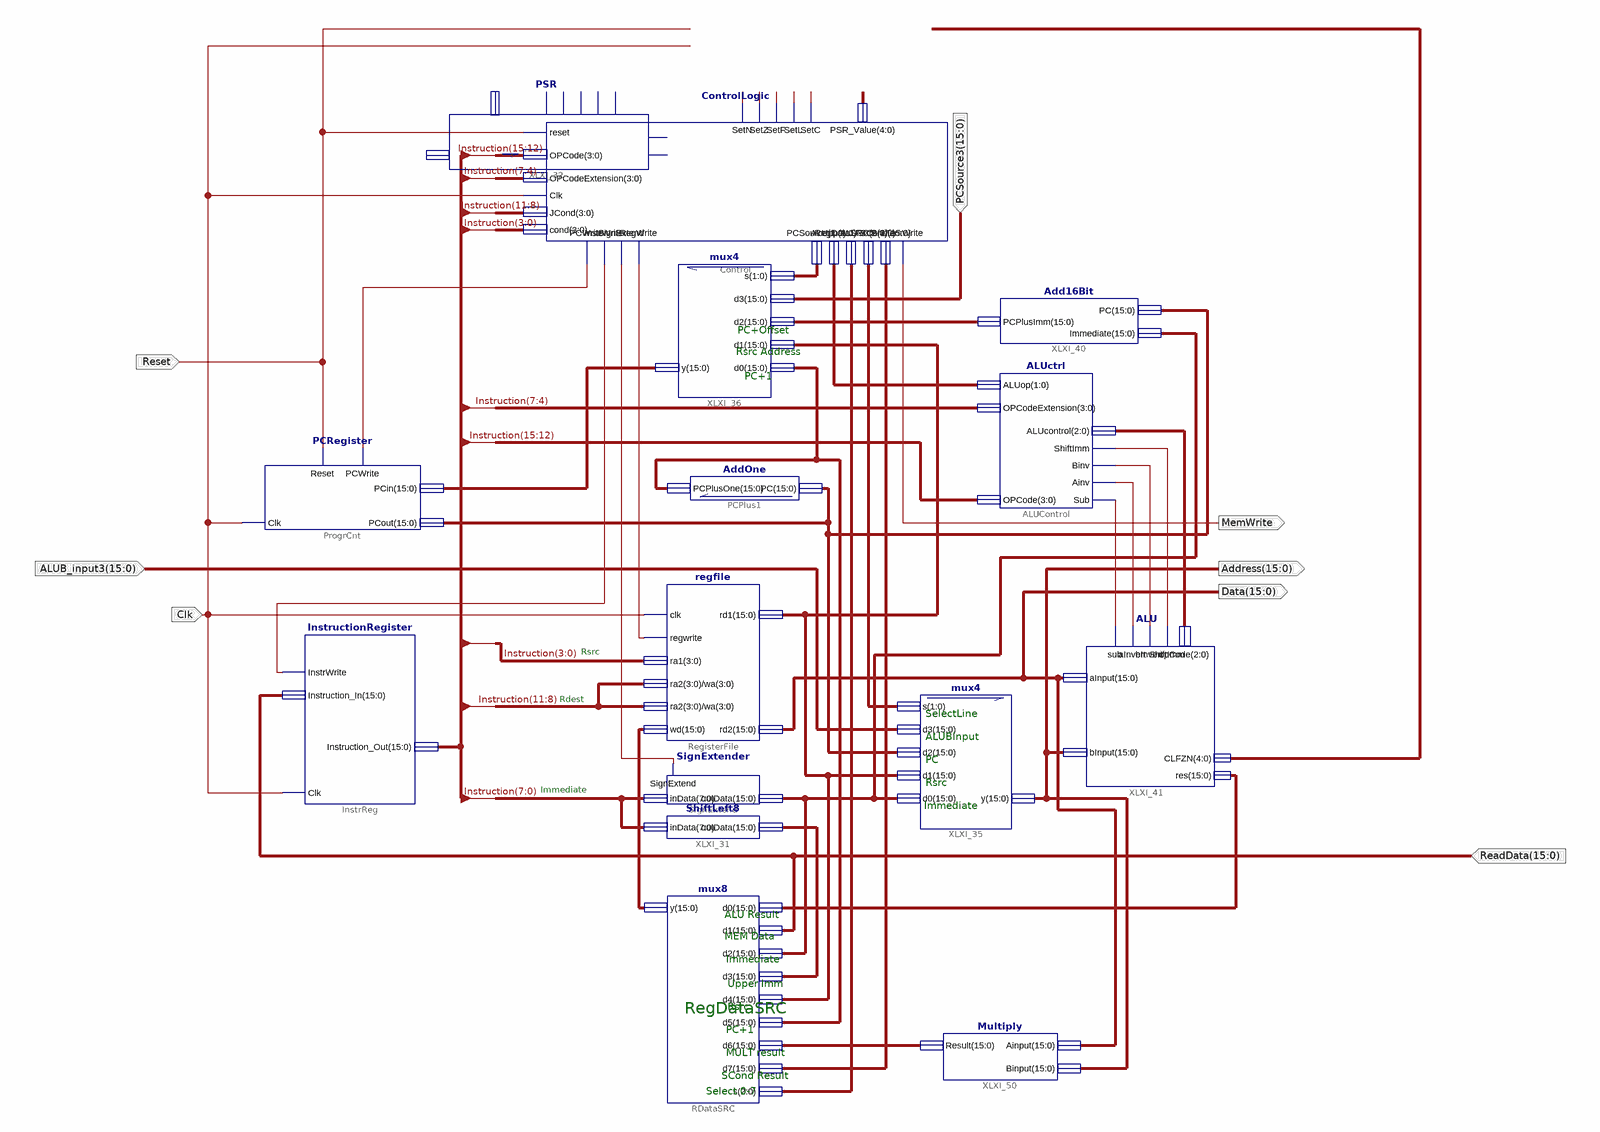
[diagram p0: schematic sheet 1]
// Xilinx ISE schematic Processor.sch (spartan3e) as structural Verilog: 15 symbols, 8 ports
module Processor (
  input  Clk,
  input  Reset,
  input  [15:0] ReadData,
  input  [15:0] ALUB_input3,
  input  [15:0] PCSource3,
  output MemWrite,
  output [15:0] Address,
  output [15:0] Data
);

  wire aInv, bInv, Cin, InstrWrite, PCWrite, RegWrite, XLXN_319, XLXN_326, XLXN_361, XLXN_362, XLXN_363,
       XLXN_364, XLXN_365;
  wire [1:0] XLXN_325, XLXN_388, XLXN_420;
  wire [2:0] XLXN_172, XLXN_342;
  wire [4:0] XLXN_372, XLXN_377;
  wire [15:0] DIV, Immediate, Instruction, MULT, ProgramCounter, Rsrc, XLXN_20, XLXN_192, XLXN_343, XLXN_344,
       XLXN_408, XLXN_413;

  regfile RegisterFile (
    .clk(Clk), .regwrite(RegWrite), .ra1(Instruction[3:0]), .ra2(Instruction[11:8]), .wa(Instruction[11:8]),
    .wd(XLXN_20), .rd1(Rsrc), .rd2(Data));
  SignExtender SignExtend (.SignExtend(XLXN_326), .inData(Instruction[7:0]), .outData(Immediate));
  ALUctrl ALUControl (
    .ALUop(XLXN_325), .OPCodeExtension(Instruction[7:4]), .OPCode(Instruction[15:12]), .Ainv(aInv),
    .Binv(bInv), .Sub(Cin), .ShiftImm(XLXN_319), .ALUcontrol(XLXN_172));
  InstructionRegister InstrReg (
    .Clk(Clk), .Instruction_In(ReadData), .Instruction_Out(Instruction), .InstrWrite(InstrWrite));
  PCRegister ProgrCnt (.PCWrite(PCWrite), .Reset(Reset), .PCin(XLXN_408), .PCout(XLXN_344), .Clk(Clk));
  AddOne PCPlus1 (.PC(XLXN_344), .PCPlusOne(ProgramCounter));
  ShiftLeft8 XLXI_31 (.inData(Instruction[7:0]), .outData(XLXN_343));
  mux8 RDataSRC (
    .d0(XLXN_192), .d1(ReadData), .d2(Immediate), .d3(XLXN_343), .d4(Rsrc), .d5(ProgramCounter), .d6(MULT),
    .d7(DIV), .s(XLXN_342), .y(XLXN_20));
  mux4 XLXI_35 (.d0(Immediate), .d1(Rsrc), .d2(XLXN_344), .d3(ALUB_input3), .s(XLXN_388), .y(Address));
  mux4 XLXI_36 (.d0(ProgramCounter), .d1(Rsrc), .d2(XLXN_413), .d3(PCSource3), .s(XLXN_420), .y(XLXN_408));
  ControlLogic Control (
    .reset(Reset), .Clk(Clk), .OPCode(Instruction[15:12]), .OPCodeExtension(Instruction[7:4]),
    .InstrWrite(InstrWrite), .RegWrite(RegWrite), .ALUSrcB(XLXN_388), .MemWrite(MemWrite),
    .SignExtend(XLXN_326), .ALUop(XLXN_325), .RegDataSRC(XLXN_342), .SetC(XLXN_361), .SetL(XLXN_362),
    .SetF(XLXN_363), .SetZ(XLXN_364), .SetN(XLXN_365), .PSR_Value(XLXN_377), .PCSource(XLXN_420),
    .PCWrite(PCWrite), .JCond(Instruction[11:8]), .SCond(DIV), .cond(Instruction[3:0]));
  PSR XLXI_32 (
    .reset(Reset), .clk(Clk), .CLFZN(XLXN_372), .SetC(XLXN_361), .SetL(XLXN_362), .SetF(XLXN_363),
    .SetZ(XLXN_364), .SetN(XLXN_365), .PState_CLFZN(XLXN_377));
  Add16Bit XLXI_40 (.PC(XLXN_344), .Immediate(Immediate), .PCPlusImm(XLXN_413));
  ALU XLXI_41 (
    .sub(Cin), .aInvert(aInv), .bInvert(bInv), .ShiftImm(XLXN_319), .aInput(Data), .bInput(Address),
    .opCode(XLXN_172), .res(XLXN_192), .CLFZN(XLXN_372));
  Multiply XLXI_50 (.Ainput(Data), .Binput(Address), .Result(MULT));

  // Notes on the sheet:
  //   PC+Offset
  //   Rsrc Address
  //   PC+1
  //   Rsrc
  //   Rdest
  //   SelectLine
  //   ALUBinput
  //   PC
  //   Rsrc
  //   Immediate
  //   Immediate
  //   ALU Result
  //   MEM Data
  //   Immediate
  //   Upper Imm
  //   Rsrc
  //   RegDataSRC
  //   PC+1
  //   MULT result
  //   SCond Result
  //   Select 0-7
endmodule
